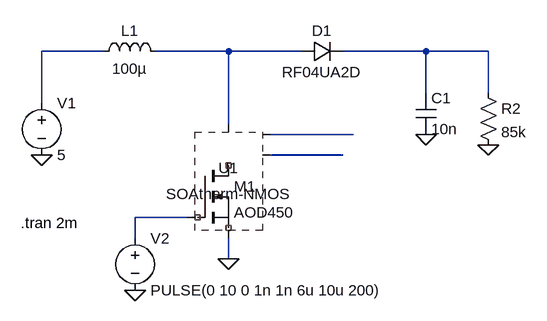
[diagram p0: schematic boost_5-170.asc]
boost_5-170.asc, the LTspice schematic file:
Version 4
SHEET 1 1780 680
WIRE 64 64 -32 64
WIRE 256 64 144 64
WIRE 368 64 256 64
WIRE 560 64 432 64
WIRE 656 64 560 64
WIRE 560 128 560 64
WIRE 656 128 656 64
WIRE -32 144 -32 64
WIRE 256 176 256 64
WIRE 448 192 320 192
WIRE 432 224 320 224
WIRE 192 320 112 320
WIRE 112 352 112 320
WIRE 256 384 256 352
FLAG -32 224 0
FLAG 112 432 0
FLAG 256 384 0
FLAG 656 208 0
FLAG 560 192 0
SYMBOL voltage -32 128 R0
WINDOW 123 0 0 Left 0
WINDOW 39 24 124 Left 2
SYMATTR InstName V1
SYMATTR Value 5
SYMBOL voltage 112 336 R0
WINDOW 123 0 0 Left 0
WINDOW 39 0 0 Left 0
SYMATTR InstName V2
SYMATTR Value PULSE(0 10 0 1n 1n 6u 10u 200)
SYMBOL nmos 208 240 R0
SYMATTR InstName M1
SYMATTR Value AOD450
SYMBOL ind 48 80 R270
WINDOW 0 32 56 VTop 2
WINDOW 3 5 56 VBottom 2
SYMATTR InstName L1
SYMATTR Value 100µ
SYMBOL diode 368 80 R270
WINDOW 0 32 32 VTop 2
WINDOW 3 0 32 VBottom 2
SYMATTR InstName D1
SYMATTR Value RF04UA2D
SYMBOL res 640 112 R0
SYMATTR InstName R2
SYMATTR Value 85k
SYMBOL cap 544 128 R0
SYMATTR InstName C1
SYMATTR Value 10n
SYMBOL SOAtherm-NMOS 256 288 R0
SYMATTR InstName U1
TEXT -64 328 Left 2 !.tran 2m

The netlist it stands for:
* boost_5-170.asc
V1 N001 0 5
V2 N006 0 PULSE(0 10 0 1n 1n 6u 10u 200)
M1 NC_01 NC_02 NC_03 NC_03 AOD450
L1 N001 N002 100µ
D1 N002 N003 RF04UA2D
R2 N003 0 85k
C1 N003 0 10n
* U1: SOAtherm-NMOS (symbol SOAtherm-NMOS not available, pin order unknown); nets seen at it: 0, N002, N004, N005, N006
.model D D
.lib standard.dio
.model NMOS NMOS
.model PMOS PMOS
.lib standard.mos
.tran 2m
.backanno
.end